# Altium schematic sheet Misc.SchDoc
size A4
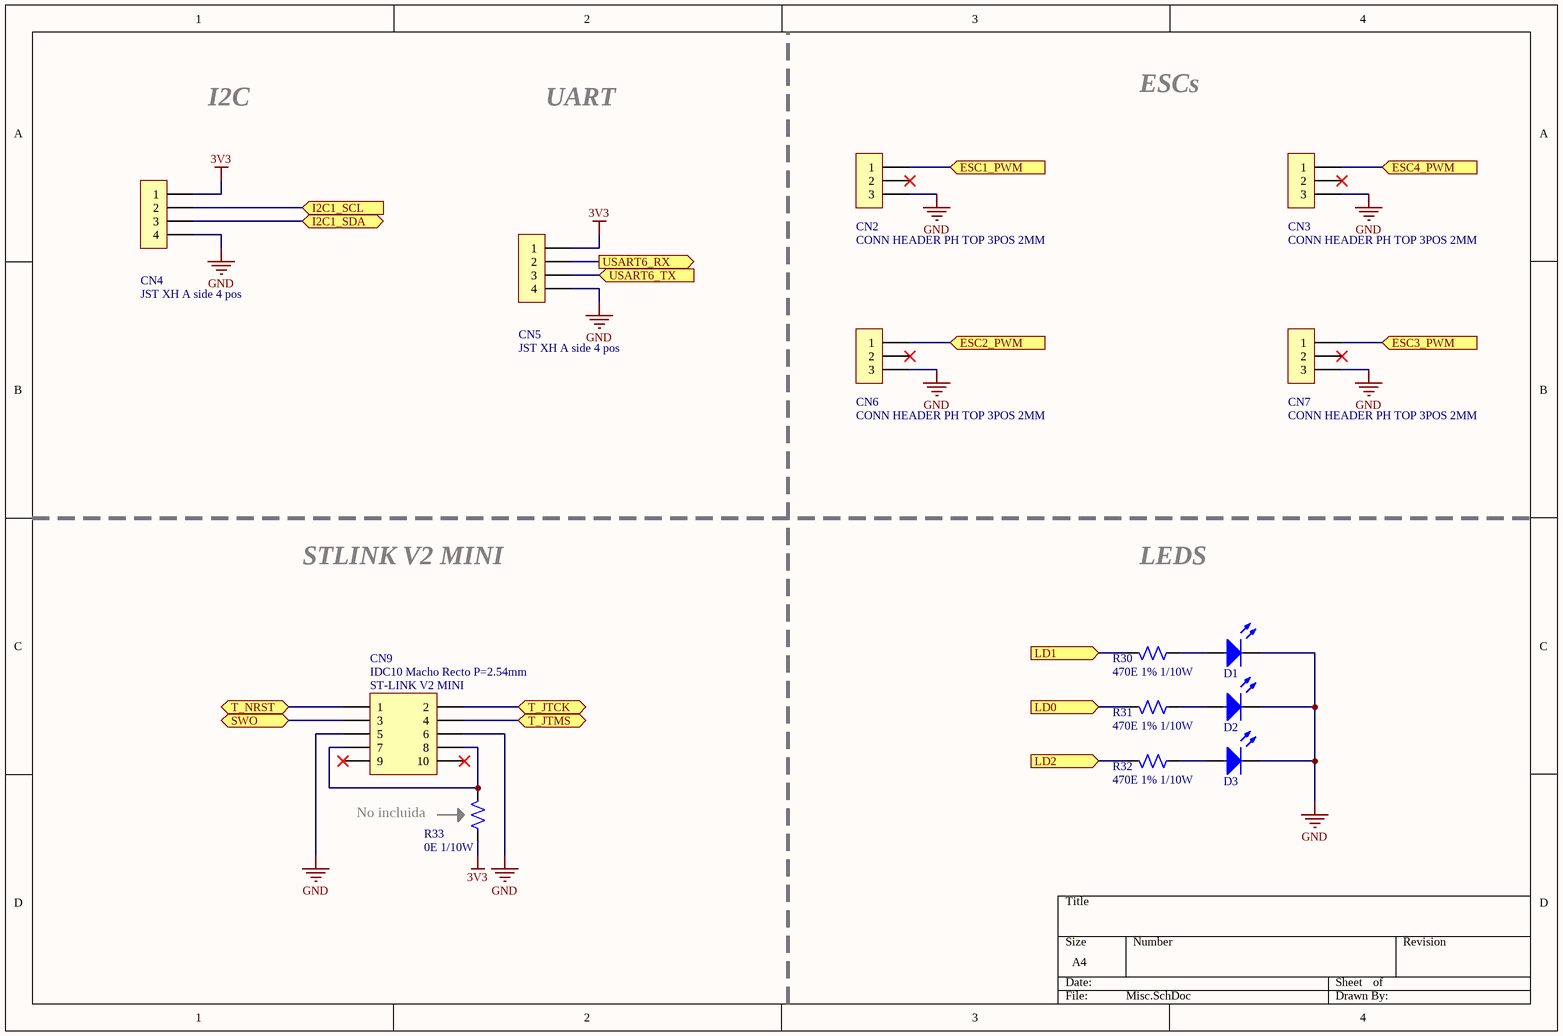
[diagram p0: Misc.SchDoc]

## Parts
CN2  CONN HEADER PH TOP 3POS 2MM  [JST-PH_3]
CN3  CONN HEADER PH TOP 3POS 2MM  [JST-PH_3]
CN4  JST XH A side 4 pos  [S4B-XH-A]
CN5  JST XH A side 4 pos  [S4B-XH-A]
CN6  CONN HEADER PH TOP 3POS 2MM  [JST-PH_3]
CN7  CONN HEADER PH TOP 3POS 2MM  [JST-PH_3]
CN9  IDC10 Macho Recto P=2.54mm  [IDC10M]
D1  Led  [LED_0805]  (value not drawn)
D2  Led  [LED_0805]  (value not drawn)
D3  Led  [LED_0805]  (value not drawn)
R30  470E 1% 1/10W  [R0603]
R31  470E 1% 1/10W  [R0603]
R32  470E 1% 1/10W  [R0603]
R33  0E 1/10W  [R0805]

## Ports
ESC1_PWM (in), ESC2_PWM (in), ESC3_PWM (in), ESC4_PWM (in), I2C1_SCL (in), I2C1_SDA (bidir), LD0 (in), LD1 (in), LD2 (in), SWO, T_JTCK, T_JTMS, T_NRST, USART6_RX (out), USART6_TX (in)

## Nets
3V3: CN4.1 CN5.1 R33.1
GND: CN2.3 CN3.3 CN4.4 CN5.4 CN6.3 CN7.3 CN9.5 CN9.6 D1.2 D2.2 D3.2
ESC1_PWM: CN2.1 ; port ESC1_PWM
ESC2_PWM: CN6.1 ; port ESC2_PWM
ESC3_PWM: CN7.1 ; port ESC3_PWM
ESC4_PWM: CN3.1 ; port ESC4_PWM
I2C1_SCL: CN4.2 ; port I2C1_SCL
I2C1_SDA: CN4.3 ; port I2C1_SDA
LD0: R31.2 ; port LD0
LD1: R30.2 ; port LD1
LD2: R32.2 ; port LD2
SWO: CN9.3 ; port SWO
T_JTCK: CN9.2 ; port T_JTCK
T_JTMS: CN9.4 ; port T_JTMS
T_NRST: CN9.1 ; port T_NRST
USART6_RX: CN5.2 ; port USART6_RX
USART6_TX: CN5.3 ; port USART6_TX
NetCN9_7: CN9.7 CN9.8 R33.2
NetD1_1: D1.1 R30.1
NetD2_1: D2.1 R31.1
NetD3_1: D3.1 R32.1

Not connected (* = marked no-connect by the designer): CN2 2*; CN3 2*; CN6 2*; CN7 2*; CN9 9* 10*

## Notes on the sheet
- I2C
- UART
- ESCs
- STLINK V2 MINI
- LEDS
- No incluida
- (in symbol Header_5x2H) ST-LINK V2 MINI

## Library data of the parts
CN2 CN3 CN6 CN7 = Header_3: Header, 3-pin; Cod. Proveedor: 455-1705-ND; Proveedor: Digikey; Encapsulado: Through Hole; Link: https://www.digikey.com
CN4 CN5 = Header_4: Header, 4-pin
CN9 = Header_5x2H: Header, 5x2-pin pinout horizontal; Proveedor: SDV Electronica; Encapsulado: Through Hole; Link: http://www.sdvelectronica.com.ar/conector-macho-recto-cable-plano-idc-10-pines-10-uni-139259442xJM
D1-D3 = Led: Diodo Led
R30-R32 = Resistor: Resistencia; Cod. Proveedor: 603-RC0603FR-10470RL; Proveedor: Mouser; Encapsulado: R0603; Valor: 470E; Link: https://ar.mouser.com
R33 = Resistor: Resistencia; Cod. Proveedor: RS3895900; Proveedor: Mouser; Encapsulado: MODIFICAR; Valor: 0E; Link: https://ar.mouser.com